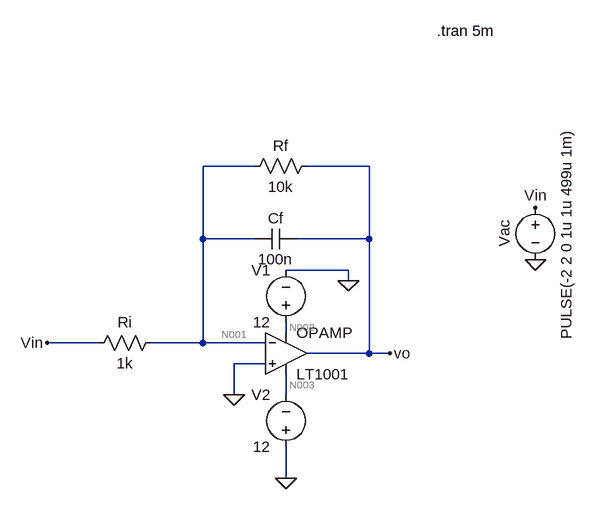
[diagram p0: schematic exp82.asc]
exp82.asc, the LTspice schematic file:
Version 4
SHEET 1 880 680
WIRE 240 -32 160 -32
WIRE 416 -32 320 -32
WIRE 160 80 160 -32
WIRE 240 80 160 80
WIRE 416 80 416 -32
WIRE 416 80 304 80
WIRE 384 128 288 128
WIRE 384 144 384 128
WIRE 288 224 288 208
WIRE 0 240 -80 240
WIRE 160 240 160 80
WIRE 160 240 80 240
WIRE 256 240 160 240
WIRE 416 256 416 80
WIRE 416 256 320 256
WIRE 448 256 416 256
WIRE 256 272 208 272
WIRE 208 320 208 272
WIRE 288 320 288 288
WIRE 288 448 288 400
FLAG 448 256 vo
FLAG 672 112 0
FLAG 672 32 Vin
FLAG 208 320 0
FLAG -80 240 Vin
FLAG 288 448 0
FLAG 384 144 0
SYMBOL OpAmps\\LT1001 288 192 R0
SYMATTR InstName OPAMP
SYMBOL voltage 672 16 R0
WINDOW 0 -32 56 VBottom 2
WINDOW 3 32 56 VTop 2
WINDOW 123 0 0 Left 0
WINDOW 39 0 0 Left 0
SYMATTR InstName Vac
SYMATTR Value PULSE(-2 2 0 1u 1u 499u 1m)
SYMBOL cap 304 64 R90
WINDOW 0 0 32 VBottom 2
WINDOW 3 32 32 VTop 2
SYMATTR InstName Cf
SYMATTR Value 100n
SYMBOL res 336 -48 R90
WINDOW 0 0 56 VBottom 2
WINDOW 3 32 56 VTop 2
SYMATTR InstName Rf
SYMATTR Value 10k
SYMBOL res 96 224 R90
WINDOW 0 0 56 VBottom 2
WINDOW 3 32 56 VTop 2
SYMATTR InstName Ri
SYMATTR Value 1k
SYMBOL voltage 288 224 R180
WINDOW 0 24 96 Left 2
WINDOW 3 24 16 Left 2
WINDOW 123 0 0 Left 0
WINDOW 39 0 0 Left 0
SYMATTR InstName V1
SYMATTR Value 12
SYMBOL voltage 288 416 R180
WINDOW 0 24 96 Left 2
WINDOW 3 24 16 Left 2
WINDOW 123 0 0 Left 0
WINDOW 39 0 0 Left 0
SYMATTR InstName V2
SYMATTR Value 12
TEXT 520 -240 Left 2 !.tran 5m

The netlist it stands for:
* exp82.asc
XOPAMP 0 N001 N002 N003 vo LT1001  ; pins In+ In- V+ V- OUT
Vac Vin 0 PULSE(-2 2 0 1u 1u 499u 1m)
Cf vo N001 100n
Rf vo N001 10k
Ri N001 Vin 1k
V1 N002 0 12
V2 0 N003 12
.tran 5m
.lib LTC.lib
.backanno
.end

* Results of the author's LTspice run, read from the files saved beside the schematic
* Operating Point, zero values left out:
*   V(n001) = -815.6 mV
*   V(n002) = 12 V
*   V(n003) = -12 V
*   V(vo) = 11.03 V
*   V(vin) = -2 V
*   I(Ri) = 1.184 mA
*   I(Rf) = 1.184 mA
*   I(V2) = -1.7 mA
*   I(V1) = -2.877 mA
*   I(Vac) = 1.184 mA
*   Ix(opamp:1) = 11.01 nA
*   Ix(opamp:2) = -11.01 nA
*   Ix(opamp:3) = 2.877 mA
*   Ix(opamp:4) = -1.7 mA
*   Ix(opamp:5) = -1.184 mA
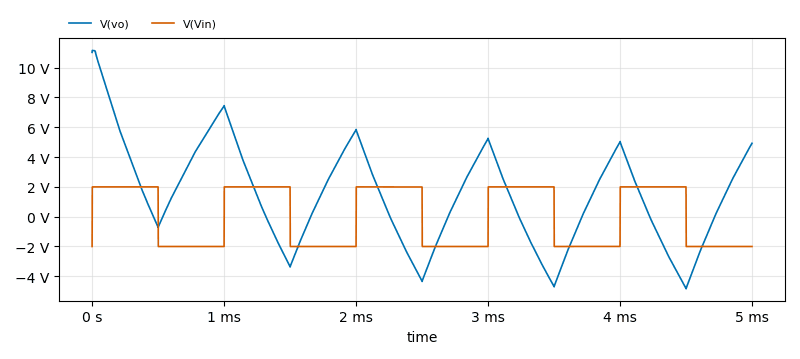
[diagram p1: Transient Analysis of exp82.asc, plotted from the saved traces]
* Transient Analysis, 1 run:
*   V(vo): min -4.839 V, max 11.16 V, average 1.372 V, rms 3.717 V, last 4.926 V
*   V(Vin): min -2 V, max 2 V, average 0 V, rms 1.999 V, last -2 V